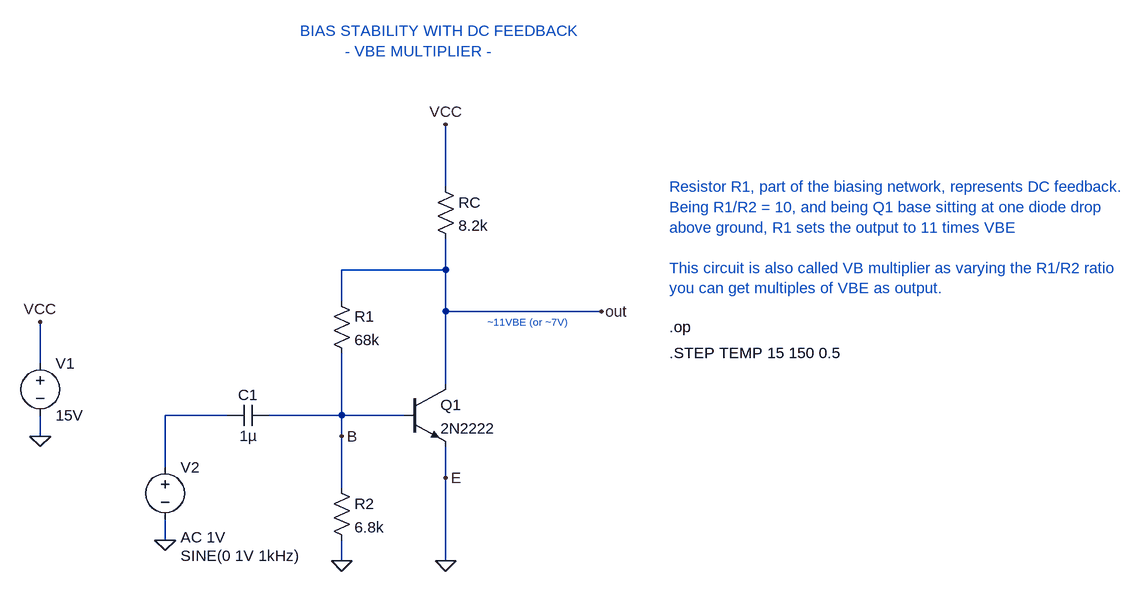
[diagram p0: schematic Figure2.42.asc]
Figure2.42.asc, the LTspice schematic file:
Version 4
SHEET 1 1468 680
WIRE 224 -176 224 -272
WIRE 224 -48 224 -96
WIRE 224 -48 64 -48
WIRE 64 0 64 -48
WIRE 224 16 224 -48
WIRE 464 16 224 16
WIRE -400 96 -400 32
WIRE 224 128 224 16
WIRE -112 176 -208 176
WIRE 64 176 64 80
WIRE 64 176 -48 176
WIRE 160 176 64 176
WIRE -400 208 -400 176
WIRE 64 208 64 176
WIRE -208 256 -208 176
WIRE 224 272 224 224
WIRE 64 288 64 208
WIRE -208 368 -208 336
WIRE 64 400 64 368
WIRE 224 400 224 272
FLAG -400 208 0
FLAG 64 400 0
FLAG 224 400 0
FLAG -400 32 VCC
FLAG 224 -272 VCC
FLAG 464 16 out
FLAG -208 368 0
FLAG 64 208 B
FLAG 224 272 E
DATAFLAG 48 176 ""
DATAFLAG 352 16 ""
SYMBOL npn 160 128 R0
SYMATTR InstName Q1
SYMATTR Value 2N2222
SYMBOL res 48 -16 R0
SYMATTR InstName R1
SYMATTR Value 68k
SYMBOL res 48 272 R0
SYMATTR InstName R2
SYMATTR Value 6.8k
SYMBOL res 208 -192 R0
SYMATTR InstName RC
SYMATTR Value 8.2k
SYMBOL voltage -400 80 R0
WINDOW 123 0 0 Left 0
WINDOW 39 0 0 Left 0
SYMATTR InstName V1
SYMATTR Value 15V
SYMBOL cap -48 160 R90
WINDOW 0 0 32 VBottom 2
WINDOW 3 32 32 VTop 2
SYMATTR InstName C1
SYMATTR Value 1µ
SYMBOL voltage -208 240 R0
WINDOW 3 24 152 Left 2
WINDOW 123 24 124 Left 2
WINDOW 39 0 0 Left 0
SYMATTR Value SINE(0 1V 1kHz)
SYMATTR Value2 AC 1V
SYMATTR InstName V2
TEXT 0 -416 Left 2 ;BIAS STABILITY WITH DC FEEDBACK\n          - VBE MULTIPLIER -
TEXT 288 32 Left 1 ;~11VBE (or ~7V)
TEXT 568 -176 Left 2 ;Resistor R1, part of the biasing network, represents DC feedback.\nBeing R1/R2 = 10, and being Q1 base sitting at one diode drop \nabove ground, R1 sets the output to 11 times VBE\n \nThis circuit is also called VB multiplier as varying the R1/R2 ratio \nyou can get multiples of VBE as output.
TEXT 568 40 Left 2 !.op
TEXT 568 80 Left 2 !.STEP TEMP 15 150 0.5

The netlist it stands for:
* Figure2.42.asc
Q1 out B 0 0 2N2222
R1 out B 68k
R2 B 0 6.8k
RC VCC out 8.2k
V1 VCC 0 15V
C1 B N001 1µ
V2 N001 0 SINE(0 1V 1kHz) AC 1V
.model NPN NPN
.model PNP PNP
.lib standard.bjt
* BIAS STABILITY WITH DC FEEDBACK
*           - VBE MULTIPLIER -
* ~11VBE (or ~7V)
* Resistor R1, part of the biasing network, represents DC feedback.
* Being R1/R2 = 10, and being Q1 base sitting at one diode drop
* above ground, R1 sets the output to 11 times VBE
* This circuit is also called VB multiplier as varying the R1/R2 ratio
* you can get multiples of VBE as output.
.op
.STEP TEMP 15 150 0.5
.backanno
.end